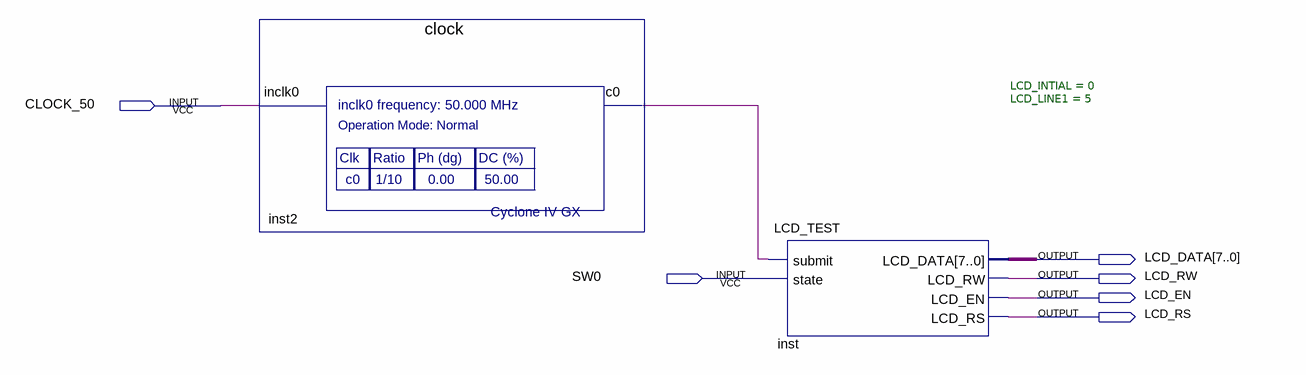
[diagram p0: schematic sheet]
// Quartus schematic test_LCD.bdf as structural Verilog: 2 symbols, 6 pins
module test_LCD (
  input  CLOCK_50,
  input  SW0,
  output [7:0] LCD_DATA,
  output LCD_RW,
  output LCD_EN,
  output LCD_RS
);

  wire inst2_c0;

  clock inst2 (.inclk0(CLOCK_50), .c0(inst2_c0));
  LCD_TEST #(.LCD_INTIAL(0), .LCD_LINE1(5)) inst (
    .submit(inst2_c0), .state(SW0), .LCD_DATA(LCD_DATA), .LCD_RW(LCD_RW), .LCD_EN(LCD_EN), .LCD_RS(LCD_RS));
endmodule
